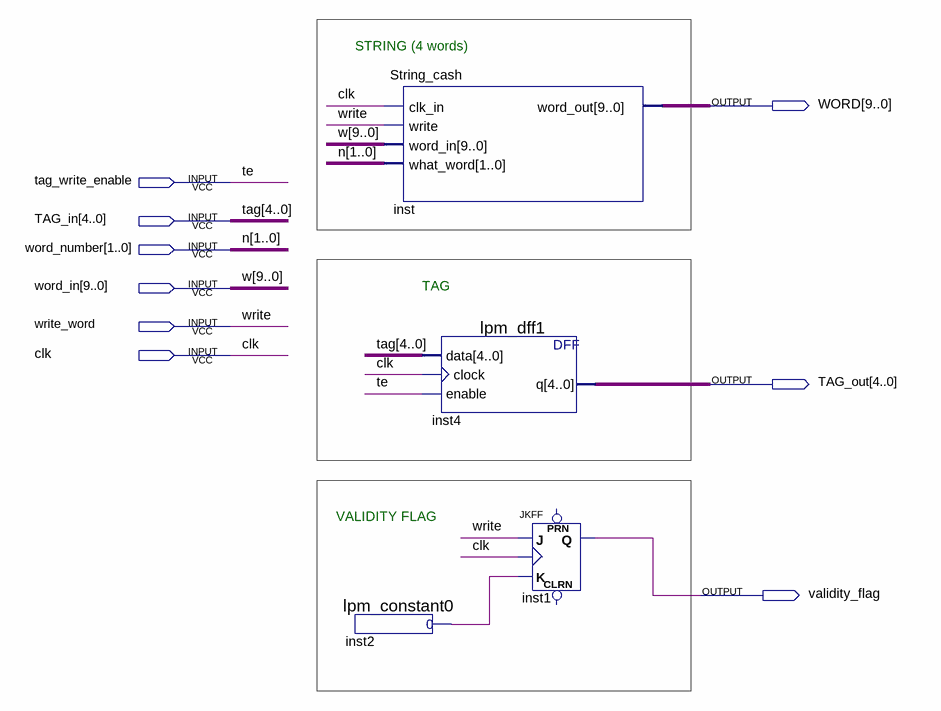
[diagram p0: schematic sheet]
// Quartus schematic Tag_and_string.bdf as structural Verilog: 4 symbols, 9 pins
module Tag_and_string (
  input  tag_write_enable,
  input  [4:0] TAG_in,
  input  [1:0] word_number,
  input  [9:0] word_in,
  input  write_word,
  input  clk,
  output [9:0] WORD,
  output [4:0] TAG_out,
  output validity_flag
);

  wire inst2_result;

  lpm_constant0 inst2 (.result(inst2_result));
  String_cash inst (.clk_in(clk), .write(write_word), .word_in(word_in), .what_word(word_number), .word_out(WORD));
  lpm_dff1 inst4 (.data(TAG_in), .clock(clk), .enable(tag_write_enable), .q(TAG_out));
  JKFF inst1 (.K(inst2_result), .J(write_word), .CLK(clk), .Q(validity_flag));  // open: PRN, CLRN

  // Other names for the same wires on the sheet: n[1:0] = word_number; tag[4:0] = TAG_in; te = tag_write_enable;
  //   w[9:0] = word_in; write = write_word

  // Notes on the sheet:
  //   STRING (4 words)
  //   TAG
  //   VALIDITY FLAG
endmodule
